# Altium schematic sheet Sheet1.SchDoc (part 1 of 2)
size A1; SheetNumber: 1; SheetTotal: 1; ENG_APP_DATE: --/--/--; DSN_APP_DATE: --/--/--; CHK_APP_DATE: --/--/--
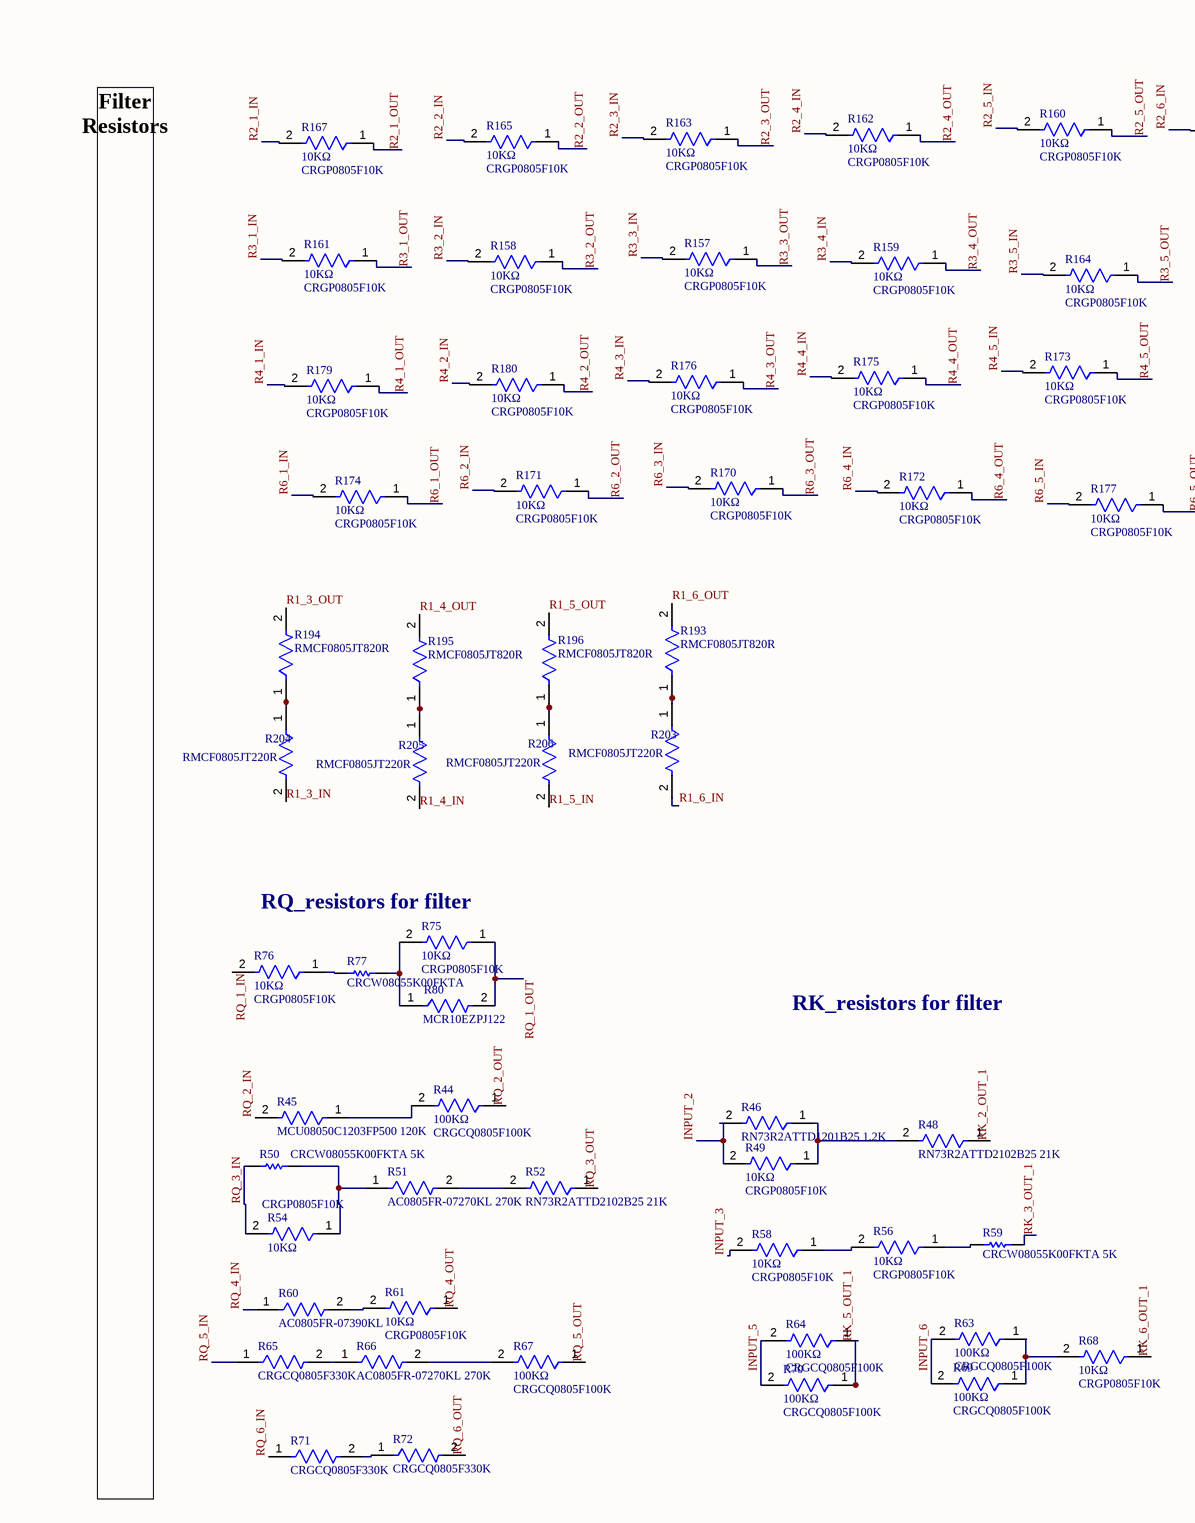
[diagram p0: Sheet1.SchDoc, top left]
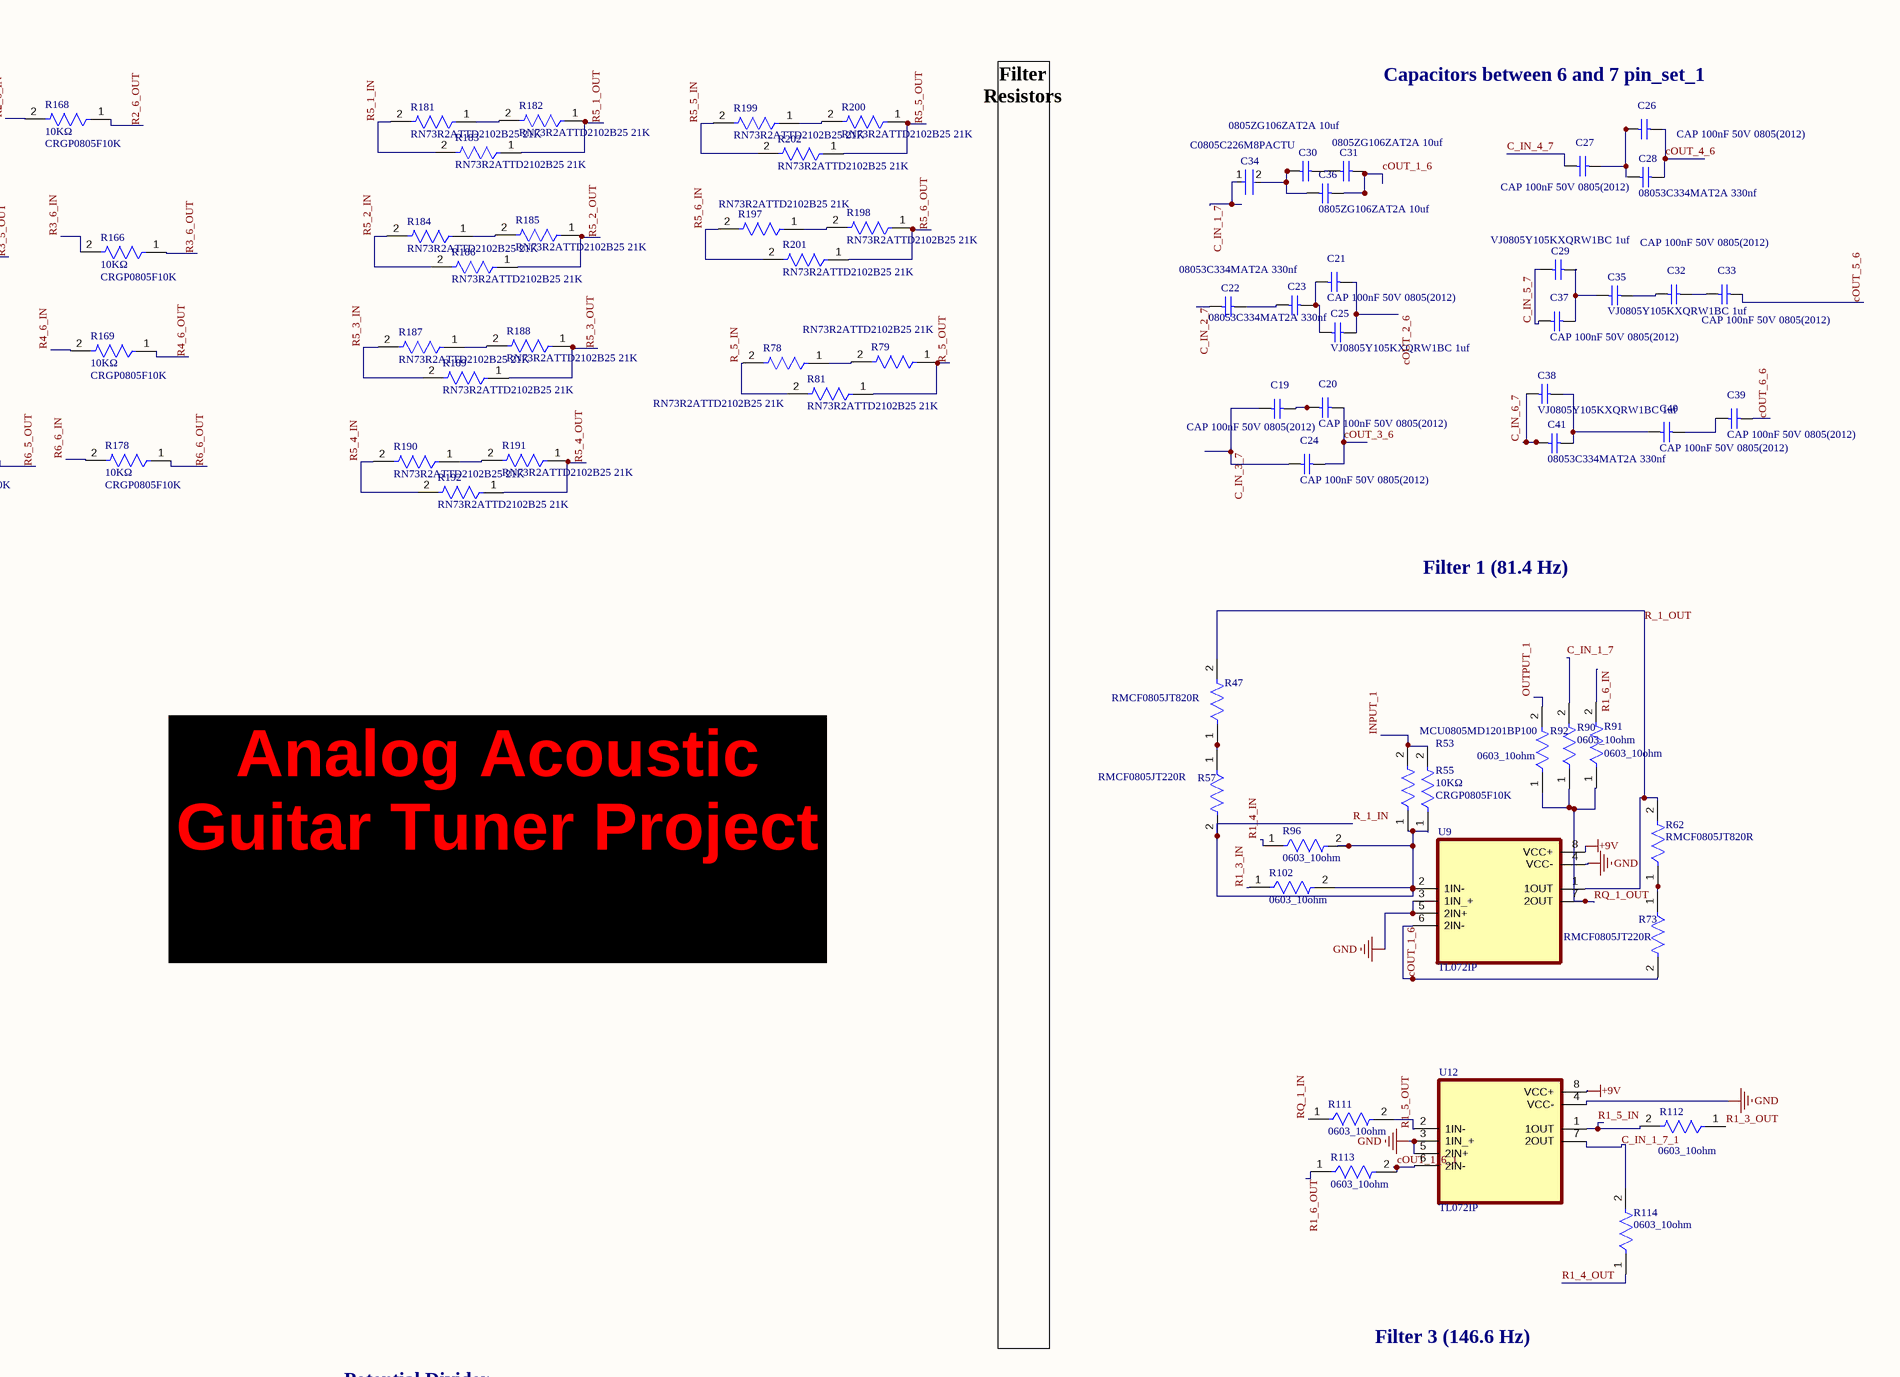
[diagram p1: Sheet1.SchDoc, top middle]
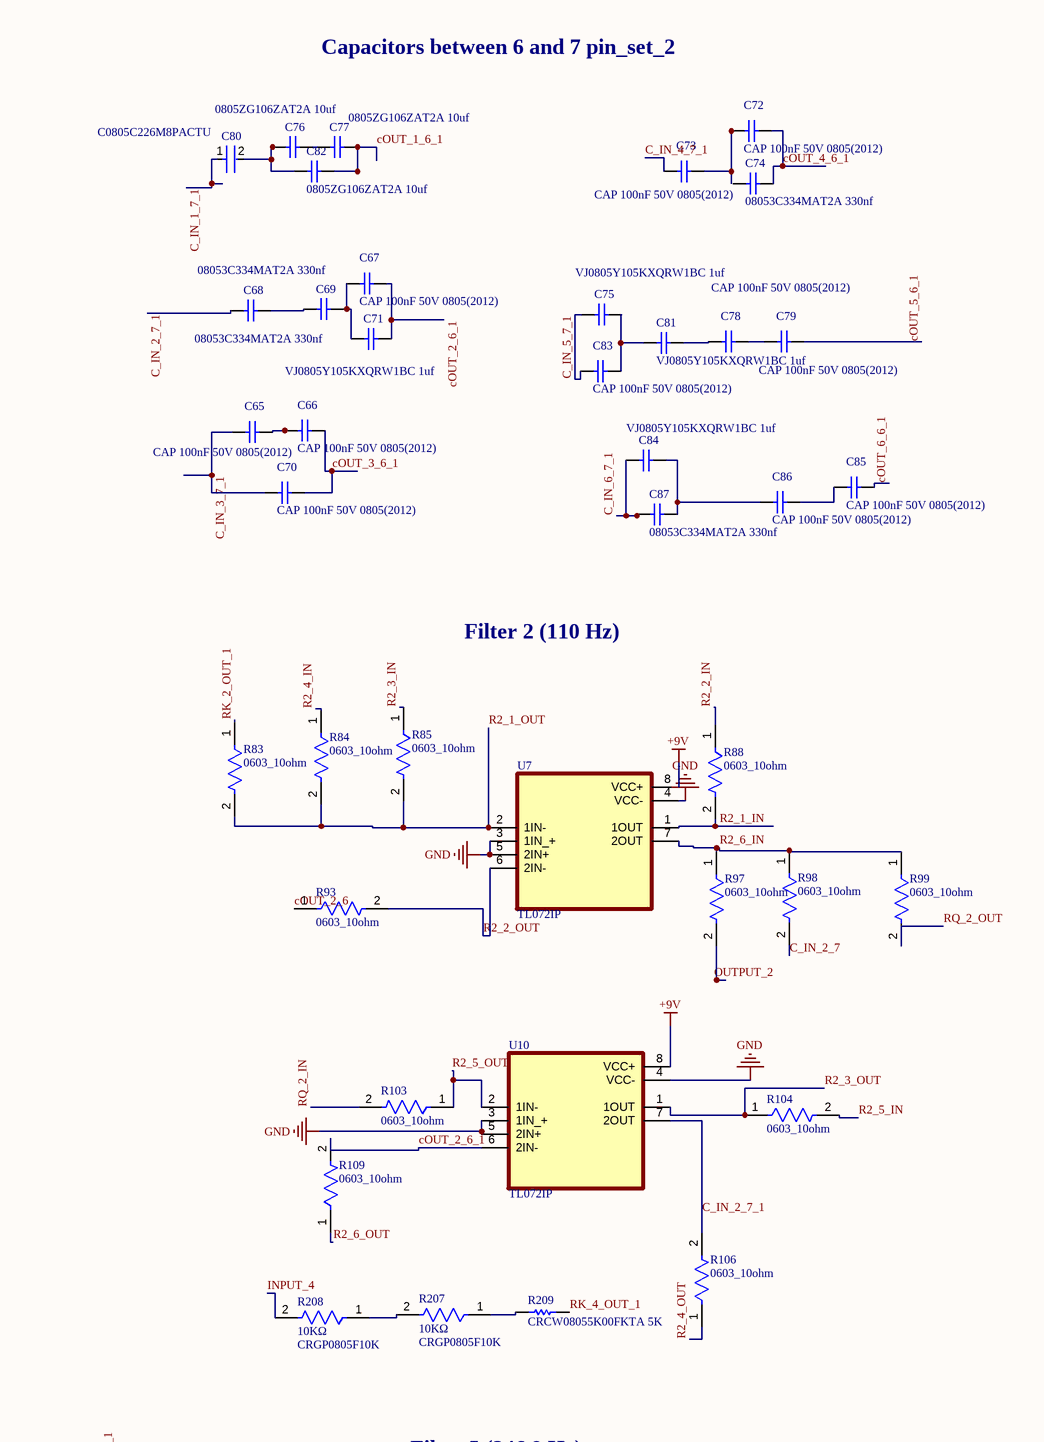
[diagram p2: Sheet1.SchDoc, top right]
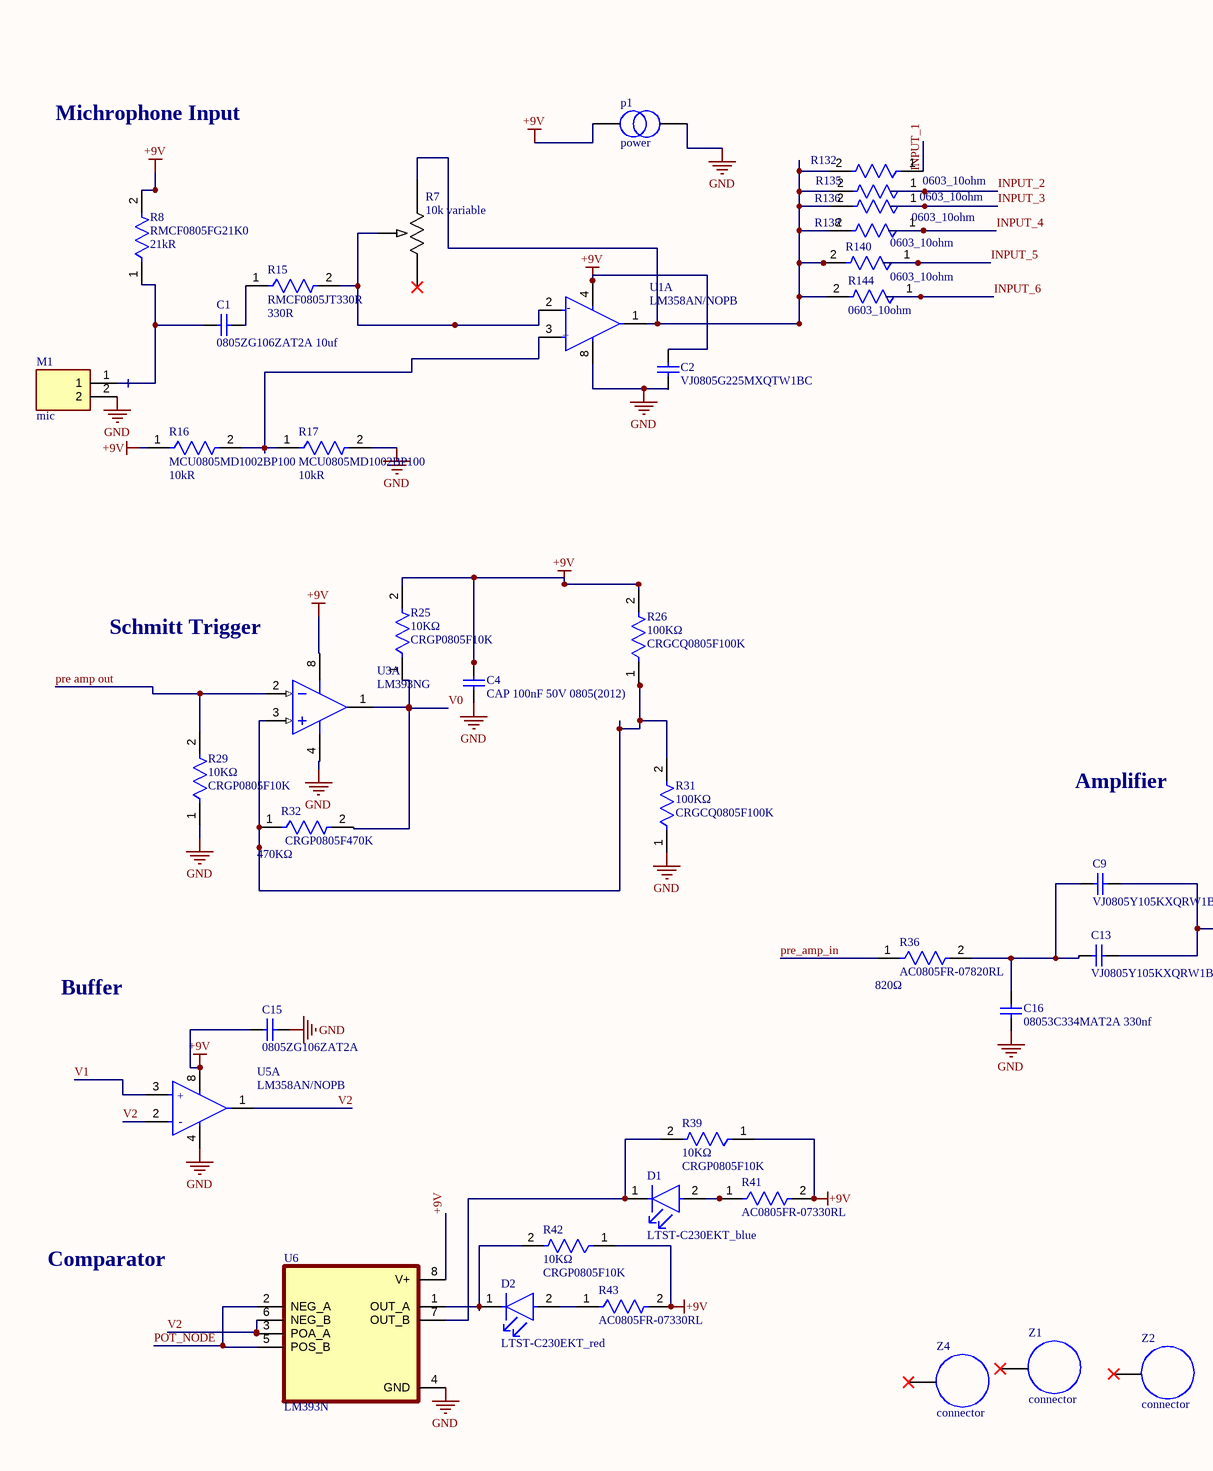
[diagram p3: Sheet1.SchDoc, bottom left]
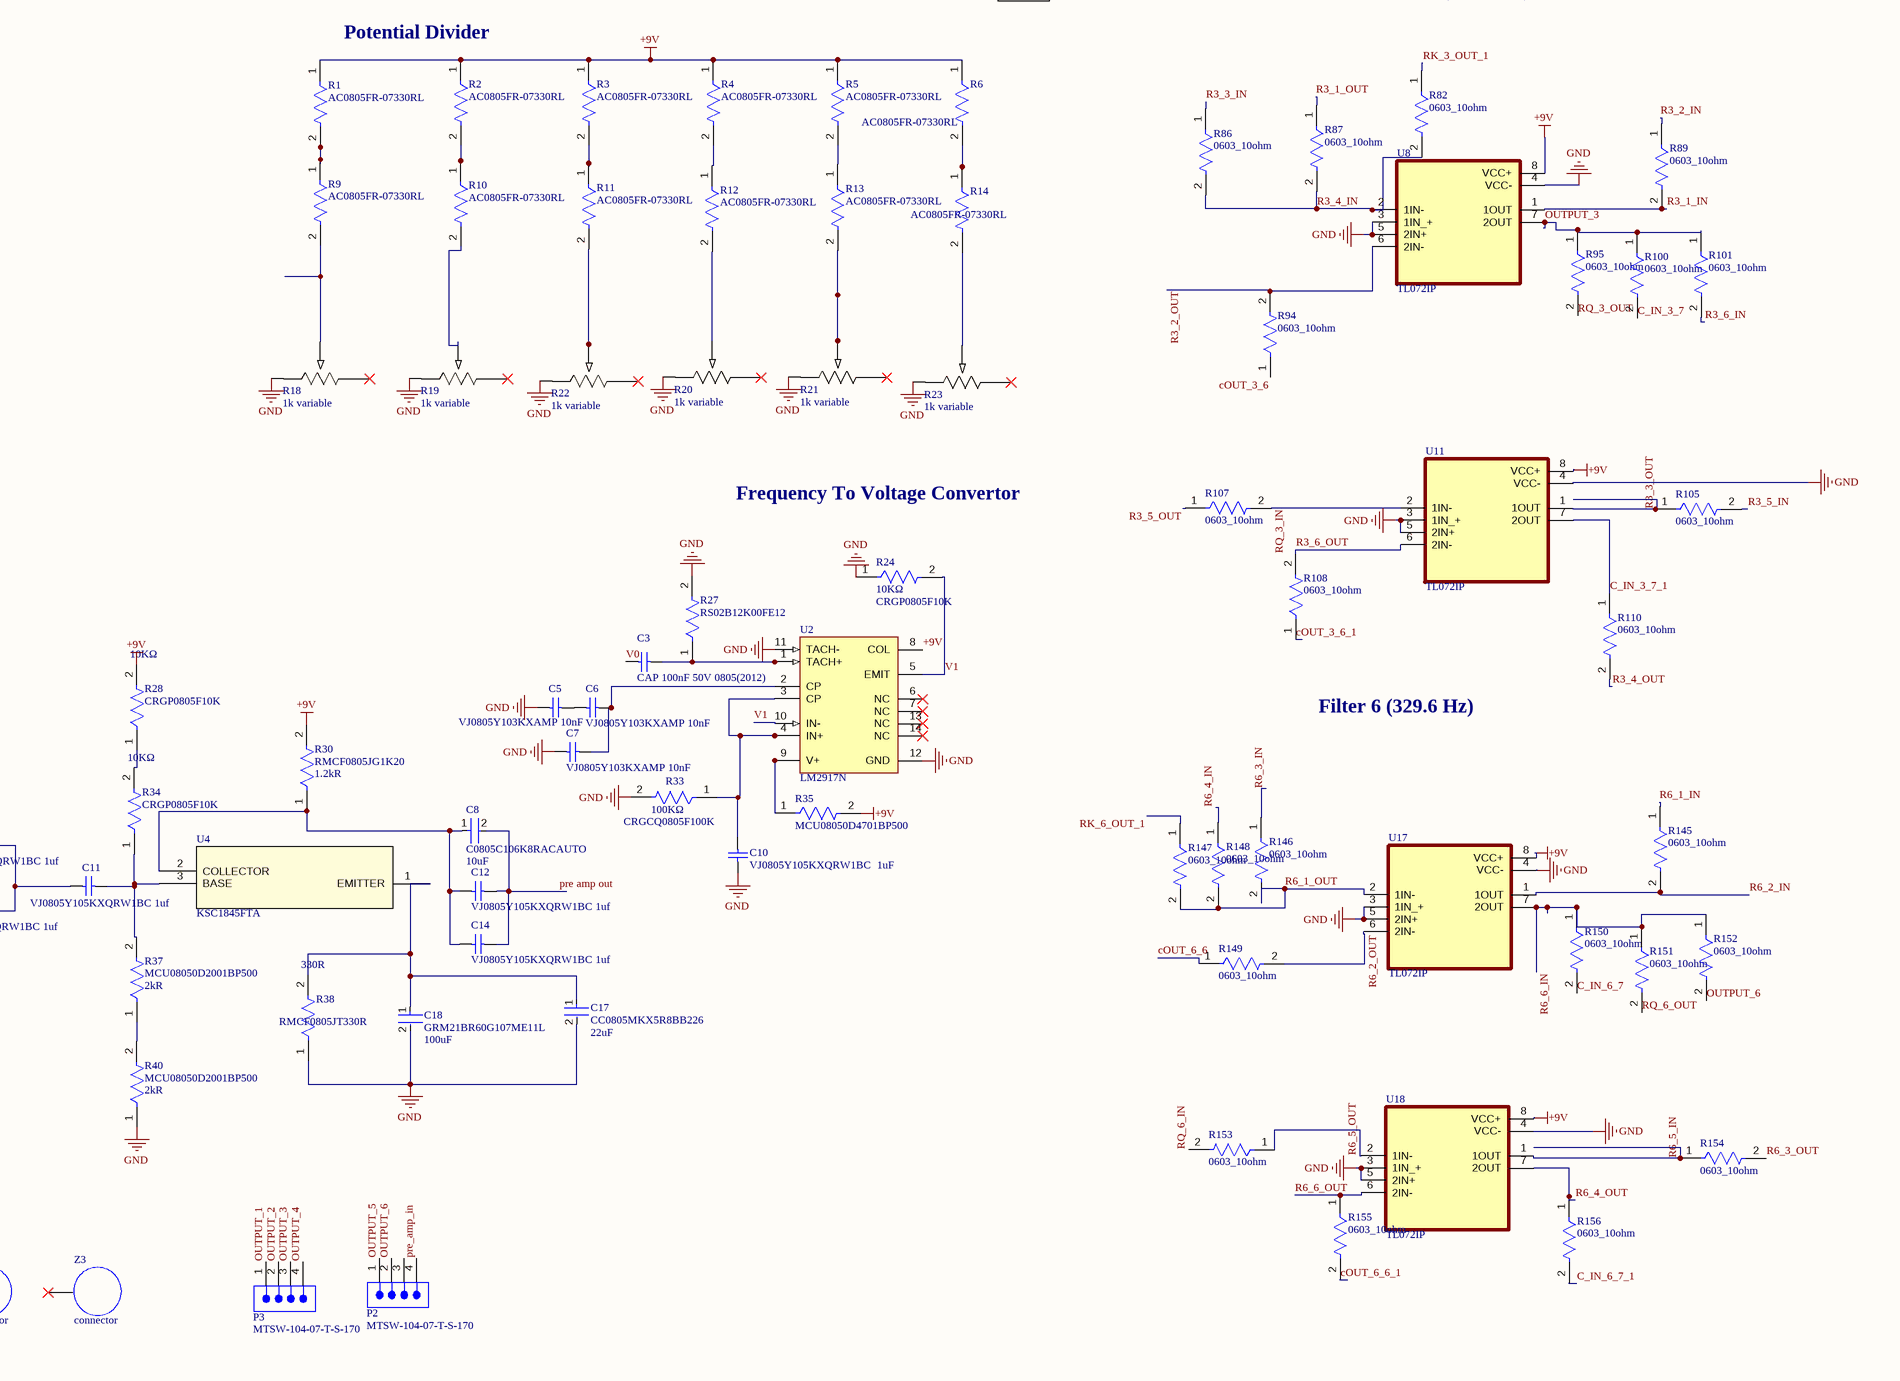
[diagram p4: Sheet1.SchDoc, bottom middle]
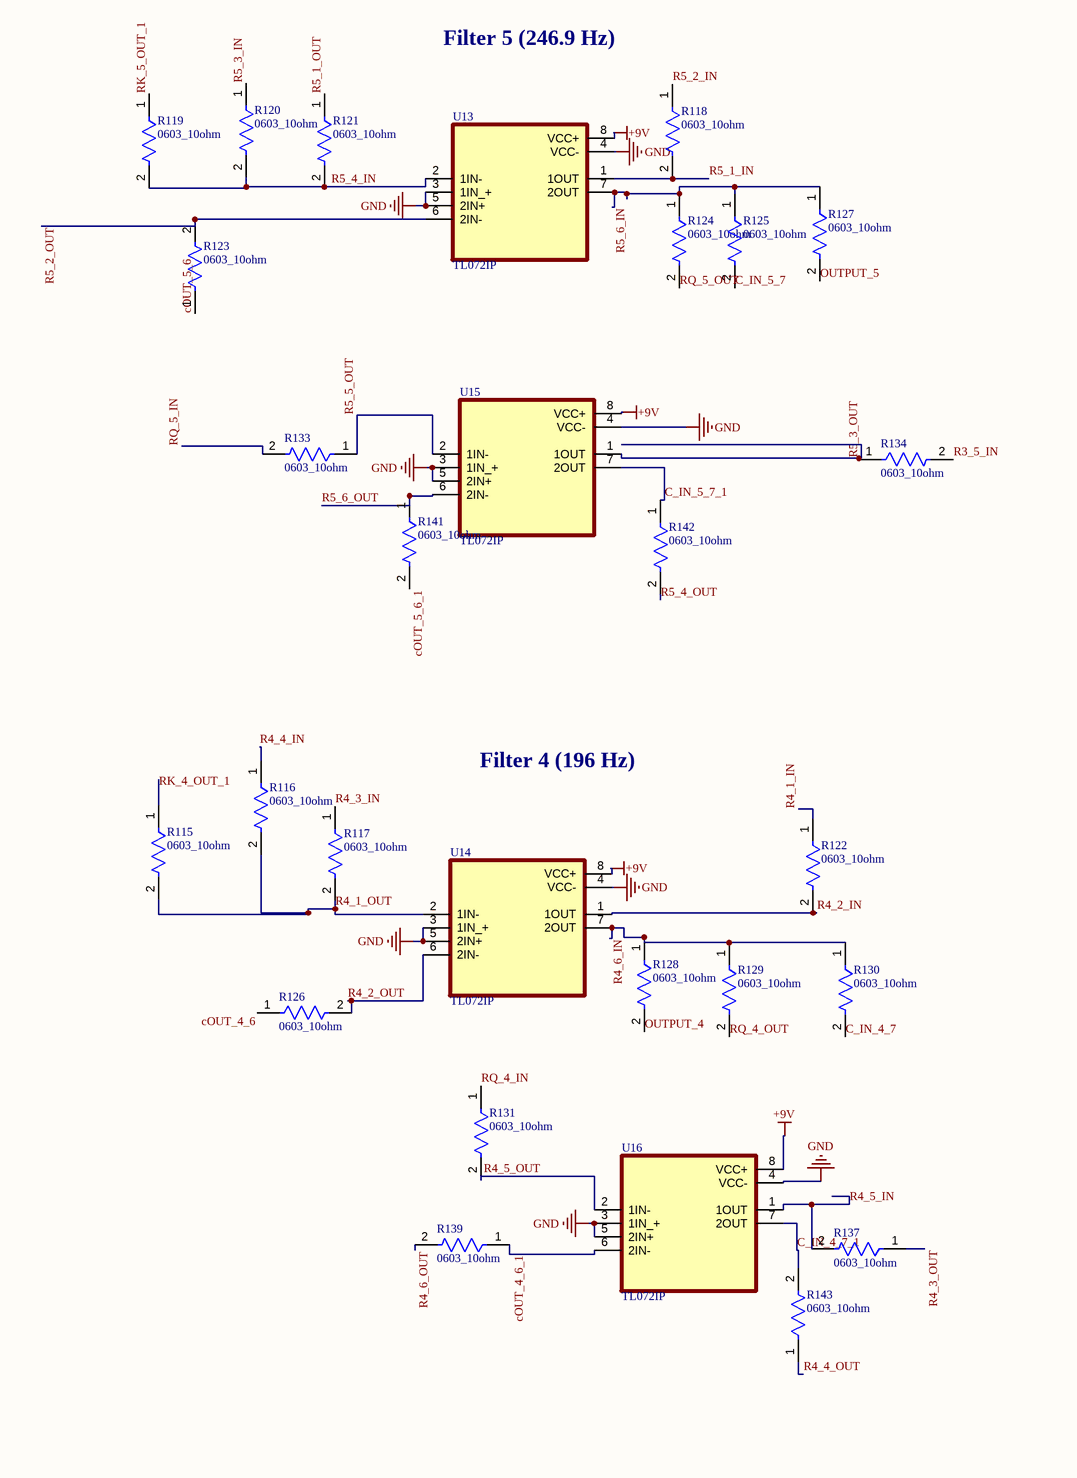
[diagram p5: Sheet1.SchDoc, bottom right]

## Parts
C1  0805ZG106ZAT2A 10uf  [CAPC2013X152X50NL20T25]
C2  VJ0805G225MXQTW1BC  [CAPC2013X145X50ML20T20]
C3  CAP 100nF 50V 0805(2012)  [CAPC0805(2012)145_N]
C4  CAP 100nF 50V 0805(2012)  [CAPC0805(2012)145_N]
C5  VJ0805Y103KXAMP 10nF  [CAPC2013X145X48LL20T23]
C6  VJ0805Y103KXAMP 10nF  [CAPC2013X145X48LL20T23]
C7  VJ0805Y103KXAMP 10nF  [CAPC2013X145X48LL20T23]
C8  C0805C106K8RACAUTO  Capacitance: 10uF  [FP-C0805C106K8RACAUTO-MFG]
C9  VJ0805Y105KXQRW1BC 1uf  [CAPC2013X145X50NL20T20]
C10  VJ0805Y105KXQRW1BC  1uF  [CAPC2013X145X50NL20T20]
C11  VJ0805Y105KXQRW1BC 1uf  [CAPC2013X145X50NL20T20]
C12  VJ0805Y105KXQRW1BC 1uf  [CAPC2013X145X50NL20T20]
C13  VJ0805Y105KXQRW1BC 1uf  [CAPC2013X145X50NL20T20]
C14  VJ0805Y105KXQRW1BC 1uf  [CAPC2013X145X50NL20T20]
C15  0805ZG106ZAT2A  [CAPC2013X152X50NL20T25]
C16  08053C334MAT2A 330nf  [CAPC2013X140X50ML20T25]
C17  CC0805MKX5R8BB226  Capacitance: 22uF  [FP-CC0805-0_2-1_45-IPC_C]
C18  GRM21BR60G107ME11L  Capacitance: 100uF  [FP-GRM21B-0_2-e0_2_0_7-MFG]
C19  CAP 100nF 50V 0805(2012)  [CAPC0805(2012)145_N]
C20  CAP 100nF 50V 0805(2012)  [CAPC0805(2012)145_N]
C21  CAP 100nF 50V 0805(2012)  [CAPC0805(2012)145_N]
C22  08053C334MAT2A 330nf  [CAPC2013X140X50ML20T25]
C23  08053C334MAT2A 330nf  [CAPC2013X140X50ML20T25]
C24  CAP 100nF 50V 0805(2012)  [CAPC0805(2012)145_N]
C25  VJ0805Y105KXQRW1BC 1uf  [CAPC2013X145X50NL20T20]
C26  CAP 100nF 50V 0805(2012)  [CAPC0805(2012)145_N]
C27  CAP 100nF 50V 0805(2012)  [CAPC0805(2012)145_N]
C28  08053C334MAT2A 330nf  [CAPC2013X140X50ML20T25]
C29  VJ0805Y105KXQRW1BC 1uf  [CAPC2013X145X50NL20T20]
C30  0805ZG106ZAT2A 10uf  [CAPC2013X152X50NL20T25]
C31  0805ZG106ZAT2A 10uf  [CAPC2013X152X50NL20T25]
C32  CAP 100nF 50V 0805(2012)  [CAPC0805(2012)145_N]
C33  CAP 100nF 50V 0805(2012)  [CAPC0805(2012)145_N]
C34  C0805C226M8PACTU  [FP-C0805C226M8PACTU-MFG]
C35  VJ0805Y105KXQRW1BC 1uf  [CAPC2013X145X50NL20T20]
C36  0805ZG106ZAT2A 10uf  [CAPC2013X152X50NL20T25]
C37  CAP 100nF 50V 0805(2012)  [CAPC0805(2012)145_N]
C38  VJ0805Y105KXQRW1BC 1uf  [CAPC2013X145X50NL20T20]
C39  CAP 100nF 50V 0805(2012)  [CAPC0805(2012)145_N]
C40  CAP 100nF 50V 0805(2012)  [CAPC0805(2012)145_N]
C41  08053C334MAT2A 330nf  [CAPC2013X140X50ML20T25]
C65  CAP 100nF 50V 0805(2012)  [CAPC0805(2012)145_N]
C66  CAP 100nF 50V 0805(2012)  [CAPC0805(2012)145_N]
C67  CAP 100nF 50V 0805(2012)  [CAPC0805(2012)145_N]
C68  08053C334MAT2A 330nf  [CAPC2013X140X50ML20T25]
C69  08053C334MAT2A 330nf  [CAPC2013X140X50ML20T25]
C70  CAP 100nF 50V 0805(2012)  [CAPC0805(2012)145_N]
C71  VJ0805Y105KXQRW1BC 1uf  [CAPC2013X145X50NL20T20]
C72  CAP 100nF 50V 0805(2012)  [CAPC0805(2012)145_N]
C73  CAP 100nF 50V 0805(2012)  [CAPC0805(2012)145_N]
C74  08053C334MAT2A 330nf  [CAPC2013X140X50ML20T25]
C75  VJ0805Y105KXQRW1BC 1uf  [CAPC2013X145X50NL20T20]
C76  0805ZG106ZAT2A 10uf  [CAPC2013X152X50NL20T25]
C77  0805ZG106ZAT2A 10uf  [CAPC2013X152X50NL20T25]
C78  CAP 100nF 50V 0805(2012)  [CAPC0805(2012)145_N]
C79  CAP 100nF 50V 0805(2012)  [CAPC0805(2012)145_N]
C80  C0805C226M8PACTU  [FP-C0805C226M8PACTU-MFG]
C81  VJ0805Y105KXQRW1BC 1uf  [CAPC2013X145X50NL20T20]
C82  0805ZG106ZAT2A 10uf  [CAPC2013X152X50NL20T25]
C83  CAP 100nF 50V 0805(2012)  [CAPC0805(2012)145_N]
C84  VJ0805Y105KXQRW1BC 1uf  [CAPC2013X145X50NL20T20]
C85  CAP 100nF 50V 0805(2012)  [CAPC0805(2012)145_N]
C86  CAP 100nF 50V 0805(2012)  [CAPC0805(2012)145_N]
C87  08053C334MAT2A 330nf  [CAPC2013X140X50ML20T25]
D1  LTST-C230EKT_blue  [FP-LTST-C230EKT-MFG]
D2  LTST-C230EKT_red  [FP-LTST-C230EKT-MFG]
M1  mic  [CMA4544PFW]
p1  power  [DIP4]
P2  MTSW-104-07-T-S-170  [SMTC-MTSW-104-07-X-S-170]
P3  MTSW-104-07-T-S-170  [SMTC-MTSW-104-07-X-S-170]
R1  AC0805FR-07330RL  [FP-AC0805-MFG]
R2  AC0805FR-07330RL  [FP-AC0805-MFG]
R3  AC0805FR-07330RL  [FP-AC0805-MFG]
R4  AC0805FR-07330RL  [FP-AC0805-MFG]
R5  AC0805FR-07330RL  [FP-AC0805-MFG]
R6  AC0805FR-07330RL  [FP-AC0805-MFG]
R7  10k variable  [variablr resistor]
R8  RMCF0805FG21K0  Resistance: 21kR  [FP-RMCF0805-IPC_C]
R9  AC0805FR-07330RL  [FP-AC0805-MFG]
R10  AC0805FR-07330RL  [FP-AC0805-MFG]
R11  AC0805FR-07330RL  [FP-AC0805-MFG]
R12  AC0805FR-07330RL  [FP-AC0805-MFG]
R13  AC0805FR-07330RL  [FP-AC0805-MFG]
R14  AC0805FR-07330RL  [FP-AC0805-MFG]
R15  RMCF0805JT330R  Resistance: 330R  [FP-RMCF0805-IPC_C]
R16  MCU0805MD1002BP100  Resistance: 10kR  [FP-MCU0805-IPC_C]
R17  MCU0805MD1002BP100  Resistance: 10kR  [FP-MCU0805-IPC_C]
R18  1k variable  [variablr resistor]
R19  1k variable  [variablr resistor]
R20  1k variable  [variablr resistor]
R21  1k variable  [variablr resistor]
R22  1k variable  [variablr resistor]
R23  1k variable  [variablr resistor]
R24  CRGP0805F10K  value 10KΩ  [FP-CRGP0805-IPC_C]
R25  CRGP0805F10K  value 10KΩ  [FP-CRGP0805-IPC_C]
R26  CRGCQ0805F100K  value 100KΩ  [FP-CRGCQ0805-IPC_C]
R27  RS02B12K00FE12  [FP-RS02B-MFG]
R28  CRGP0805F10K  value 10KΩ  [FP-CRGP0805-IPC_C]
R29  CRGP0805F10K  value 10KΩ  [FP-CRGP0805-IPC_C]
R30  RMCF0805JG1K20  Resistance: 1.2kR  [FP-RMCF0805-IPC_A]
R31  CRGCQ0805F100K  value 100KΩ  [FP-CRGCQ0805-IPC_C]
R32  CRGP0805F470K  value 470KΩ  [FP-CRGP0805-IPC_C]
R33  CRGCQ0805F100K  value 100KΩ  [FP-CRGCQ0805-IPC_C]
R34  CRGP0805F10K  value 10KΩ  [FP-CRGP0805-IPC_C]
R35  MCU08050D4701BP500  [FP-MCU0805-MFG]
R36  AC0805FR-07820RL  value 820Ω  [FP-AC0805-MFG]
R37  MCU08050D2001BP500  Resistance: 2kR  [FP-MCU0805-IPC_A]
R38  RMCF0805JT330R  Resistance: 330R  [FP-RMCF0805-IPC_C]
R39  CRGP0805F10K  value 10KΩ  [FP-CRGP0805-IPC_C]
R40  MCU08050D2001BP500  Resistance: 2kR  [FP-MCU0805-IPC_A]
R41  AC0805FR-07330RL  [FP-AC0805-MFG]
R42  CRGP0805F10K  value 10KΩ  [FP-CRGP0805-IPC_C]
R43  AC0805FR-07330RL  [FP-AC0805-MFG]
R44  CRGCQ0805F100K  value 100KΩ  [FP-CRGCQ0805-IPC_C]
R45  MCU08050C1203FP500 120K  [FP-MCU0805-IPC_A]
R46  RN73R2ATTD1201B25 1.2K  [FP-RN73R2A-MFG]
R47  RMCF0805JT820R  [FP-RMCF0805-IPC_C]
R48  RN73R2ATTD2102B25 21K  [FP-RN73R2A-IPC_A]
R49  CRGP0805F10K  value 10KΩ  [FP-CRGP0805-IPC_C]
R50  CRCW08055K00FKTA 5K  [RESC2013X50X30ML20T20]
R51  AC0805FR-07270KL 270K  [FP-AC0805-MFG]
R52  RN73R2ATTD2102B25 21K  [FP-RN73R2A-IPC_A]
R53  MCU0805MD1201BP100  [FP-MCU0805-MFG]
R54  CRGP0805F10K  value 10KΩ  [FP-CRGP0805-IPC_C]
R55  CRGP0805F10K  value 10KΩ  [FP-CRGP0805-IPC_C]
R56  CRGP0805F10K  value 10KΩ  [FP-CRGP0805-IPC_C]
R57  RMCF0805JT220R  [FP-RMCF0805-IPC_A]
R58  CRGP0805F10K  value 10KΩ  [FP-CRGP0805-IPC_C]
R59  CRCW08055K00FKTA 5K  [RESC2013X50X30ML20T20]
R60  AC0805FR-07390KL  [FP-AC0805-MFG]
R61  CRGP0805F10K  value 10KΩ  [FP-CRGP0805-IPC_C]
R62  RMCF0805JT820R  [FP-RMCF0805-IPC_C]
R63  CRGCQ0805F100K  value 100KΩ  [FP-CRGCQ0805-IPC_C]
R64  CRGCQ0805F100K  value 100KΩ  [FP-CRGCQ0805-IPC_C]
R65  CRGCQ0805F330K  [FP-CRGCQ0805-IPC_C]
R66  AC0805FR-07270KL 270K  [FP-AC0805-MFG]
R67  CRGCQ0805F100K  value 100KΩ  [FP-CRGCQ0805-IPC_C]
R68  CRGP0805F10K  value 10KΩ  [FP-CRGP0805-IPC_C]
R69  CRGCQ0805F100K  value 100KΩ  [FP-CRGCQ0805-IPC_C]
R70  CRGCQ0805F100K  value 100KΩ  [FP-CRGCQ0805-IPC_C]
R71  CRGCQ0805F330K  [FP-CRGCQ0805-IPC_C]
R72  CRGCQ0805F330K  [FP-CRGCQ0805-IPC_C]
R73  RMCF0805JT220R  [FP-RMCF0805-IPC_A]
R75  CRGP0805F10K  value 10KΩ  [FP-CRGP0805-IPC_C]
R76  CRGP0805F10K  value 10KΩ  [FP-CRGP0805-IPC_C]
R77  CRCW08055K00FKTA  [RESC2013X50X30ML20T20]
R78  RN73R2ATTD2102B25 21K  [FP-RN73R2A-IPC_A]
R79  RN73R2ATTD2102B25 21K  [FP-RN73R2A-IPC_A]
R80  MCR10EZPJ122  [FP-MCR10-IPC_C]
R81  RN73R2ATTD2102B25 21K  [FP-RN73R2A-IPC_A]
R82  0603_10ohm  [FP-MCT0603-IPC_A]
R83  0603_10ohm  [FP-MCT0603-IPC_A]
R84  0603_10ohm  [FP-MCT0603-IPC_A]
R85  0603_10ohm  [FP-MCT0603-IPC_A]
R86  0603_10ohm  [FP-MCT0603-IPC_A]
R87  0603_10ohm  [FP-MCT0603-IPC_A]
R88  0603_10ohm  [FP-MCT0603-IPC_A]
R89  0603_10ohm  [FP-MCT0603-IPC_A]
R90  0603_10ohm  [FP-MCT0603-IPC_A]
R91  0603_10ohm  [FP-MCT0603-IPC_A]
R92  0603_10ohm  [FP-MCT0603-IPC_A]
R93  0603_10ohm  [FP-MCT0603-IPC_A]
R94  0603_10ohm  [FP-MCT0603-IPC_A]
R95  0603_10ohm  [FP-MCT0603-IPC_A]
R96  0603_10ohm  [FP-MCT0603-IPC_A]
R97  0603_10ohm  [FP-MCT0603-IPC_A]
R98  0603_10ohm  [FP-MCT0603-IPC_A]
R99  0603_10ohm  [FP-MCT0603-IPC_A]
R100  0603_10ohm  [FP-MCT0603-IPC_A]
R101  0603_10ohm  [FP-MCT0603-IPC_A]
R102  0603_10ohm  [FP-MCT0603-IPC_A]
R103  0603_10ohm  [FP-MCT0603-IPC_A]
R104  0603_10ohm  [FP-MCT0603-IPC_A]
R105  0603_10ohm  [FP-MCT0603-IPC_A]
R106  0603_10ohm  [FP-MCT0603-IPC_A]
R107  0603_10ohm  [FP-MCT0603-IPC_A]
R108  0603_10ohm  [FP-MCT0603-IPC_A]
R109  0603_10ohm  [FP-MCT0603-IPC_A]
R110  0603_10ohm  [FP-MCT0603-IPC_A]
R111  0603_10ohm  [FP-MCT0603-IPC_A]
R112  0603_10ohm  [FP-MCT0603-IPC_A]
R113  0603_10ohm  [FP-MCT0603-IPC_A]
R114  0603_10ohm  [FP-MCT0603-IPC_A]
R115  0603_10ohm  [FP-MCT0603-IPC_A]
R116  0603_10ohm  [FP-MCT0603-IPC_A]
R117  0603_10ohm  [FP-MCT0603-IPC_A]
R118  0603_10ohm  [FP-MCT0603-IPC_A]
R119  0603_10ohm  [FP-MCT0603-IPC_A]
R120  0603_10ohm  [FP-MCT0603-IPC_A]
R121  0603_10ohm  [FP-MCT0603-IPC_A]
R122  0603_10ohm  [FP-MCT0603-IPC_A]
R123  0603_10ohm  [FP-MCT0603-IPC_A]
R124  0603_10ohm  [FP-MCT0603-IPC_A]
R125  0603_10ohm  [FP-MCT0603-IPC_A]
R126  0603_10ohm  [FP-MCT0603-IPC_A]
R127  0603_10ohm  [FP-MCT0603-IPC_A]
R128  0603_10ohm  [FP-MCT0603-IPC_A]
R129  0603_10ohm  [FP-MCT0603-IPC_A]
R130  0603_10ohm  [FP-MCT0603-IPC_A]
R131  0603_10ohm  [FP-MCT0603-IPC_A]
R132  0603_10ohm  [FP-MCT0603-IPC_A]
R133  0603_10ohm  [FP-MCT0603-IPC_A]
R134  0603_10ohm  [FP-MCT0603-IPC_A]
R135  0603_10ohm  [FP-MCT0603-IPC_A]
R136  0603_10ohm  [FP-MCT0603-IPC_A]
R137  0603_10ohm  [FP-MCT0603-IPC_A]
R138  0603_10ohm  [FP-MCT0603-IPC_A]
R139  0603_10ohm  [FP-MCT0603-IPC_A]
R140  0603_10ohm  [FP-MCT0603-IPC_A]
R141  0603_10ohm  [FP-MCT0603-IPC_A]
R142  0603_10ohm  [FP-MCT0603-IPC_A]
R143  0603_10ohm  [FP-MCT0603-IPC_A]
R144  0603_10ohm  [FP-MCT0603-IPC_A]
R145  0603_10ohm  [FP-MCT0603-IPC_A]
R146  0603_10ohm  [FP-MCT0603-IPC_A]
R147  0603_10ohm  [FP-MCT0603-IPC_A]
R148  0603_10ohm  [FP-MCT0603-IPC_A]
R149  0603_10ohm  [FP-MCT0603-IPC_A]
R150  0603_10ohm  [FP-MCT0603-IPC_A]
R151  0603_10ohm  [FP-MCT0603-IPC_A]
R152  0603_10ohm  [FP-MCT0603-IPC_A]
R153  0603_10ohm  [FP-MCT0603-IPC_A]
R154  0603_10ohm  [FP-MCT0603-IPC_A]
R155  0603_10ohm  [FP-MCT0603-IPC_A]
R156  0603_10ohm  [FP-MCT0603-IPC_A]
R157  CRGP0805F10K  value 10KΩ  [FP-CRGP0805-IPC_C]
R158  CRGP0805F10K  value 10KΩ  [FP-CRGP0805-IPC_C]
R159  CRGP0805F10K  value 10KΩ  [FP-CRGP0805-IPC_C]
R160  CRGP0805F10K  value 10KΩ  [FP-CRGP0805-IPC_C]
R161  CRGP0805F10K  value 10KΩ  [FP-CRGP0805-IPC_C]
R162  CRGP0805F10K  value 10KΩ  [FP-CRGP0805-IPC_C]
R163  CRGP0805F10K  value 10KΩ  [FP-CRGP0805-IPC_C]
R164  CRGP0805F10K  value 10KΩ  [FP-CRGP0805-IPC_C]
R165  CRGP0805F10K  value 10KΩ  [FP-CRGP0805-IPC_C]
R166  CRGP0805F10K  value 10KΩ  [FP-CRGP0805-IPC_C]
R167  CRGP0805F10K  value 10KΩ  [FP-CRGP0805-IPC_C]
R168  CRGP0805F10K  value 10KΩ  [FP-CRGP0805-IPC_C]
R169  CRGP0805F10K  value 10KΩ  [FP-CRGP0805-IPC_C]
R170  CRGP0805F10K  value 10KΩ  [FP-CRGP0805-IPC_C]
R171  CRGP0805F10K  value 10KΩ  [FP-CRGP0805-IPC_C]
R172  CRGP0805F10K  value 10KΩ  [FP-CRGP0805-IPC_C]
R173  CRGP0805F10K  value 10KΩ  [FP-CRGP0805-IPC_C]
R174  CRGP0805F10K  value 10KΩ  [FP-CRGP0805-IPC_C]
R175  CRGP0805F10K  value 10KΩ  [FP-CRGP0805-IPC_C]
R176  CRGP0805F10K  value 10KΩ  [FP-CRGP0805-IPC_C]
R177  CRGP0805F10K  value 10KΩ  [FP-CRGP0805-IPC_C]
R178  CRGP0805F10K  value 10KΩ  [FP-CRGP0805-IPC_C]
R179  CRGP0805F10K  value 10KΩ  [FP-CRGP0805-IPC_C]
R180  CRGP0805F10K  value 10KΩ  [FP-CRGP0805-IPC_C]
R181  RN73R2ATTD2102B25 21K  [FP-RN73R2A-IPC_A]
R182  RN73R2ATTD2102B25 21K  [FP-RN73R2A-IPC_A]
R183  RN73R2ATTD2102B25 21K  [FP-RN73R2A-IPC_A]
R184  RN73R2ATTD2102B25 21K  [FP-RN73R2A-IPC_A]
R185  RN73R2ATTD2102B25 21K  [FP-RN73R2A-IPC_A]
R186  RN73R2ATTD2102B25 21K  [FP-RN73R2A-IPC_A]
R187  RN73R2ATTD2102B25 21K  [FP-RN73R2A-IPC_A]
R188  RN73R2ATTD2102B25 21K  [FP-RN73R2A-IPC_A]
R189  RN73R2ATTD2102B25 21K  [FP-RN73R2A-IPC_A]
R190  RN73R2ATTD2102B25 21K  [FP-RN73R2A-IPC_A]
R191  RN73R2ATTD2102B25 21K  [FP-RN73R2A-IPC_A]
R192  RN73R2ATTD2102B25 21K  [FP-RN73R2A-IPC_A]
R193  RMCF0805JT820R  [FP-RMCF0805-IPC_C]
R194  RMCF0805JT820R  [FP-RMCF0805-IPC_C]
R195  RMCF0805JT820R  [FP-RMCF0805-IPC_C]
R196  RMCF0805JT820R  [FP-RMCF0805-IPC_C]
R197  RN73R2ATTD2102B25 21K  [FP-RN73R2A-IPC_A]
R198  RN73R2ATTD2102B25 21K  [FP-RN73R2A-IPC_A]
R199  RN73R2ATTD2102B25 21K  [FP-RN73R2A-IPC_A]
R200  RN73R2ATTD2102B25 21K  [FP-RN73R2A-IPC_A]
R201  RN73R2ATTD2102B25 21K  [FP-RN73R2A-IPC_A]
R202  RN73R2ATTD2102B25 21K  [FP-RN73R2A-IPC_A]
R203  RMCF0805JT220R  [FP-RMCF0805-IPC_A]
R204  RMCF0805JT220R  [FP-RMCF0805-IPC_A]
R205  RMCF0805JT220R  [FP-RMCF0805-IPC_A]
R206  RMCF0805JT220R  [FP-RMCF0805-IPC_A]
R207  CRGP0805F10K  value 10KΩ  [FP-CRGP0805-IPC_C]
R208  CRGP0805F10K  value 10KΩ  [FP-CRGP0805-IPC_C]
R209  CRCW08055K00FKTA 5K  [RESC2013X50X30ML20T20]
U1  LM358AN/NOPB  [FP-P0008A-MFG]  (part A of 2)
U2  LM2917N  [N14A]
U3  LM393NG  [ONSC-PDIP-8-626-05_M]  (part A of 2)
U4  KSC1845FTA  [TO-92-3L_5P33X5P2_ONS]
U5  LM358AN/NOPB  [FP-P0008A-MFG]  (part A of 2)
U6  LM393N  [DIP794W45P254L959H508Q8]
U7  TL072IP  [DIP794W45P254L959H508Q8]
U8  TL072IP  [DIP794W45P254L959H508Q8]
U9  TL072IP  [DIP794W45P254L959H508Q8]
U10  TL072IP  [DIP794W45P254L959H508Q8]
U11  TL072IP  [DIP794W45P254L959H508Q8]
U12  TL072IP  [DIP794W45P254L959H508Q8]
U13  TL072IP  [DIP794W45P254L959H508Q8]
U14  TL072IP  [DIP794W45P254L959H508Q8]
U15  TL072IP  [DIP794W45P254L959H508Q8]
U16  TL072IP  [DIP794W45P254L959H508Q8]
U17  TL072IP  [DIP794W45P254L959H508Q8]
U18  TL072IP  [DIP794W45P254L959H508Q8]
Z1  connector  [connector]
Z2  connector  [connector]
Z3  connector  [connector]
Z4  connector  [connector]

## Nets
+9V: C2.2 C4.2 C15.1 p1.1 R1.1 R2.1 R3.1 R4.1 R5.1 R6.1 R8.2 R16.1 R25.2 R26.2 R28.2 R30.2 R35.2 R39.1 R41.2 R42.1 R43.2 U1.4(GND) U2.8(COL) U3.8(VCC) U5.8(V+) U6.8(V+) U7.8(VCC+) U8.8(VCC+) U9.8(VCC+) U10.8(VCC+) U11.8(VCC+) U12.8(VCC+) U13.8(VCC+) U14.8(VCC+) U15.8(VCC+) U16.8(VCC+) U17.8(VCC+) U18.8(VCC+)
GND: C2.1 C4.1 C5.1 C7.1 C10.1 C15.2 C16.1 C17.2 C18.2 M1.2 p1.2 R17.2 R18.1 R19.1 R20.1 R21.1 R22.1 R23.1 R24.1 R27.2 R29.1 R31.1 R33.2 R38.1 R40.1 U1.8(V+) U2.11(TACH-) U2.12(GND) U3.4(GND) U5.4(GND) U6.4(GND) U7.3(1IN_+) U7.4(VCC-) U7.5(2IN+) U8.3(1IN_+) U8.4(VCC-) U8.5(2IN+) U9.3(1IN_+) U9.4(VCC-) U9.5(2IN+) U10.3(1IN_+) U10.4(VCC-) U10.5(2IN+) U11.3(1IN_+) U11.4(VCC-) U11.5(2IN+) U12.3(1IN_+) U12.4(VCC-) U12.5(2IN+) U13.3(1IN_+) U13.4(VCC-) U13.5(2IN+) U14.3(1IN_+) U14.4(VCC-) U14.5(2IN+) U15.3(1IN_+) U15.4(VCC-) U15.5(2IN+) U16.3(1IN_+) U16.4(VCC-) U16.5(2IN+) U17.3(1IN_+) U17.4(VCC-) U17.5(2IN+) U18.3(1IN_+) U18.4(VCC-) U18.5(2IN+)
C_IN_1_7: C34.1 R90.2
C_IN_1_7_1: C80.1 R114.2 U12.7(2OUT)
C_IN_2_7: C22.2 R98.2
C_IN_2_7_1: C68.2 R106.2 U10.7(2OUT)
C_IN_3_7: C19.2 C24.2 R100.2
C_IN_3_7_1: C65.2 C70.2 R110.1 U11.7(2OUT)
C_IN_4_7: C27.2 R130.2
C_IN_4_7_1: C73.2 R143.2 U16.7(2OUT)
C_IN_5_7: C29.1 C37.2 R125.2
C_IN_5_7_1: C75.1 C83.2 R142.1 U15.7(2OUT)
C_IN_6_7: C38.1 C41.2 R150.2
C_IN_6_7_1: C84.1 C87.2 R156.2
cOUT_1_6: C31.2 C36.2 R73.2 U9.6(2IN-)
cOUT_1_6_1: C77.2 C82.2 R113.2 U12.6(2IN-)
cOUT_2_6: C21.1 C25.2 R93.1
cOUT_2_6_1: C67.1 C71.2 R109.2 U10.6(2IN-)
cOUT_3_6: C20.1 C24.1 R94.1
cOUT_3_6_1: C66.1 C70.1 R108.1
cOUT_4_6: C26.1 C28.1 R126.1
cOUT_4_6_1: C72.1 C74.1 R139.1 U16.6(2IN-)
cOUT_5_6: C33.1 R123.1
cOUT_5_6_1: C79.1 R141.2
cOUT_6_6: C39.1 R149.1
cOUT_6_6_1: C85.1 R155.2
INPUT_1: R53.2 R55.2 R132.1
INPUT_2: R46.2 R49.2 R135.1
INPUT_3: R58.2 R136.1
INPUT_4: R138.1 R208.2
INPUT_5: R64.2 R70.2 R140.1
INPUT_6: R63.2 R69.2 R144.1
OUTPUT_1: P3.1 R92.2
OUTPUT_2: P3.2 R97.2
OUTPUT_3: P3.3 R95.1 R100.1 R101.1 U8.7(2OUT)
OUTPUT_4: P3.4 R128.2
OUTPUT_5: P2.1 R127.2
OUTPUT_6: P2.2 R152.2
POT_NODE: U6.2(NEG_A) U6.5(POS_B)
pre amp out: C8.2 C12.2 C14.2 R29.2 U3.2(INA-)
pre_amp_in: P2.4 R36.1
R1_3_IN: R102.1 R204.2
R1_3_OUT: R112.1 R194.2
R1_4_IN: R96.1 R205.2
R1_4_OUT: R114.1 R195.2
R1_5_IN: R112.2 R206.2 U12.1(1OUT)
R1_5_OUT: R111.2 R196.2 U12.2(1IN-)
R1_6_IN: R91.2 R203.2
R1_6_OUT: R113.1 R193.2
R2_1_IN: R88.2 R167.2 U7.1(1OUT)
R2_1_OUT: R83.2 R84.2 R85.2 R167.1 U7.2(1IN-)
R2_2_IN: R88.1 R165.2
R2_2_OUT: R93.2 R165.1 U7.6(2IN-)
R2_3_IN: R85.1 R163.2
R2_3_OUT: R104.1 R163.1 U10.1(1OUT)
R2_4_IN: R84.1 R162.2
R2_4_OUT: R106.1 R162.1
R2_5_IN: R104.2 R160.2
R2_5_OUT: R103.1 R160.1 U10.2(1IN-)
R2_6_IN: R97.1 R98.1 R99.1 R168.2 U7.7(2OUT)
R2_6_OUT: R109.1 R168.1
R3_1_IN: R89.2 R161.2 U8.1(1OUT)
R3_1_OUT: R87.1 R161.1
R3_2_IN: R89.1 R158.2
R3_2_OUT: R94.2 R158.1 U8.6(2IN-)
R3_3_IN: R86.1 R157.2
R3_3_OUT: R105.1 R157.1 U11.1(1OUT)
R3_4_IN: R82.2 R86.2 R87.2 R159.2 U8.2(1IN-)
R3_4_OUT: R110.2 R159.1
R3_5_IN: R105.2 R134.2 R164.2
R3_5_OUT: R107.1 R164.1
R3_6_IN: R101.2 R166.2
R3_6_OUT: R108.2 R166.1 U11.6(2IN-)
R4_1_IN: R122.1 R179.2
R4_1_OUT: R115.2 R116.2 R117.2 R179.1 U14.2(1IN-)
R4_2_IN: R122.2 R180.2 U14.1(1OUT)
R4_2_OUT: R126.2 R180.1 U14.6(2IN-)
R4_3_IN: R117.1 R176.2
R4_3_OUT: R137.1 R176.1
R4_4_IN: R116.1 R175.2
R4_4_OUT: R143.1 R175.1
R4_5_IN: R137.2 R173.2 U16.1(1OUT)
R4_5_OUT: R131.2 R173.1 U16.2(1IN-)
R4_6_IN: R128.1 R129.1 R130.1 R169.2 U14.7(2OUT)
R4_6_OUT: R139.2 R169.1
R5_1_IN: R118.2 R181.2 R183.2 U13.1(1OUT)
R5_1_OUT: R121.1 R182.1 R183.1
R5_2_IN: R118.1 R184.2 R186.2
R5_2_OUT: R123.2 R185.1 R186.1 U13.6(2IN-)
R5_3_IN: R120.1 R187.2 R189.2
R5_3_OUT: R134.1 R188.1 R189.1 U15.1(1OUT)
R5_4_IN: R119.2 R120.2 R121.2 R190.2 R192.2 U13.2(1IN-)
R5_4_OUT: R142.2 R191.1 R192.1
R5_5_IN: R199.2 R202.2
R5_5_OUT: R133.1 R200.1 R202.1 U15.2(1IN-)
R5_6_IN: R124.1 R125.1 R127.1 R197.2 R201.2 U13.7(2OUT)
R5_6_OUT: R141.1 R198.1 R201.1 U15.6(2IN-)
R6_1_IN: R145.1 R174.2
R6_1_OUT: R146.2 R147.2 R148.2 R174.1 U17.2(1IN-)
R6_2_IN: R145.2 R171.2 U17.1(1OUT)
R6_2_OUT: R149.2 R171.1 U17.6(2IN-)
R6_3_IN: R146.1 R170.2
R6_3_OUT: R154.2 R170.1
R6_4_IN: R148.1 R172.2
R6_4_OUT: R156.1 R172.1 U18.7(2OUT)
R6_5_IN: R154.1 R177.2 U18.1(1OUT)
R6_5_OUT: R153.1 R177.1 U18.2(1IN-)
R6_6_IN: R150.1 R151.1 R152.1 R178.2 U17.7(2OUT)
R6_6_OUT: R155.1 R178.1 U18.6(2IN-)
R_1_IN: R53.1 R55.1 R57.2 R96.2 R102.2 U9.2(1IN-)
R_1_OUT: R47.2 R62.2 U9.1(1OUT)
R_5_IN: R78.2 R81.2
R_5_OUT: R79.1 R81.1
RK_2_OUT_1: R48.1 R83.1
RK_3_OUT_1: R59.1 R82.1
RK_4_OUT_1: R115.1 R209.1
RK_5_OUT_1: R64.1 R70.1 R119.1
RK_6_OUT_1: R68.1 R147.1
RQ_1_IN: R76.2 R111.1
RQ_1_OUT: R75.1 R80.2 R90.1 R91.1 R92.1 U9.7(2OUT)
RQ_2_IN: R45.2 R103.2
RQ_2_OUT: R44.1 R99.2
RQ_3_IN: R50.2 R54.2 R107.2 U11.2(1IN-)
RQ_3_OUT: R52.1 R95.2
RQ_4_IN: R60.1 R131.1
RQ_4_OUT: R61.1 R129.2
RQ_5_IN: R65.1 R133.2
RQ_5_OUT: R67.1 R124.2
RQ_6_IN: R71.1 R153.2
RQ_6_OUT: R72.2 R151.2
V0: C3.2 R25.1 R32.2 U3.1(OUTA)
V1: R24.2 U2.5(EMIT) U2.10(IN-) U5.3(NON-INVERTING_INPUT_A)
V2: U5.1(OUTPUT_A) U5.2(INVERTING_INPUT_A) U6.3(POA_A) U6.6(NEG_B)
NetC1_1: C1.1 M1.1 R8.1
NetC1_2: C1.2 R15.1
NetC3_1: C3.1 R27.1 U2.1(TACH+)
NetC5_2: C5.2 C6.1
NetC6_2: C6.2 C7.2 U2.2(CP)
NetC8_1: C8.1 C12.1 C14.1 R30.1 U4.2(COLLECTOR)
NetC9_1: C9.1 C13.1 C16.2 R36.2
NetC9_2: C9.2 C11.1 C13.2
NetC10_2: C10.2 R33.1 U2.3(CP) U2.4(IN+)
NetC11_2: C11.2 R34.1 R37.2 U4.3(BASE)
NetC17_1: C17.1 C18.1 R38.2 U4.1(EMITTER)
NetC19_1: C19.1 C20.2
NetC21_2: C21.2 C23.2 C25.1
NetC22_1: C22.1 C23.1
NetC26_2: C26.2 C27.1
NetC29_2: C29.2 C35.1 C37.1
NetC30_1: C30.1 C34.2 C36.1
NetC30_2: C30.2 C31.1
NetC32_1: C32.1 C33.2
NetC32_2: C32.2 C35.2
NetC38_2: C38.2 C40.2 C41.1
NetC39_2: C39.2 C40.1
NetC65_1: C65.1 C66.2
NetC67_2: C67.2 C69.2 C71.1
NetC68_1: C68.1 C69.1
NetC72_2: C72.2 C73.1
NetC75_2: C75.2 C81.1 C83.1
NetC76_1: C76.1 C80.2 C82.1
NetC76_2: C76.2 C77.1
NetC78_1: C78.1 C79.2
NetC78_2: C78.2 C81.2
NetC84_2: C84.2 C86.2 C87.1
NetC85_2: C85.2 C86.1
NetD1_1: D1.1(C) R39.2 U6.7(OUT_B)
NetD1_2: D1.2(A) R41.1
NetD2_1: D2.1(C) R42.2 U6.1(OUT_A)
NetD2_2: D2.2(A) R43.1
NetR1_2: R1.2 R9.1
NetR2_2: R2.2 R10.1
NetR3_2: R3.2 R11.1
NetR4_2: R4.2 R12.1
NetR5_2: R5.2 R13.1
NetR6_2: R6.2 R14.1
NetR7_2: R7.2 R15.2 U1.2(INVERTING_INPUT_A)
NetR7_3: R7.3 R132.2 R135.2 R136.2 R138.2 R140.2 R144.2 U1.1(OUTPUT_A)
NetR9_2: R9.2 R18.2
NetR10_2: R10.2 R19.2
NetR11_2: R11.2 R22.2
NetR12_2: R12.2 R20.2
NetR13_2: R13.2 R21.2
NetR14_2: R14.2 R23.2
NetR16_2: R16.2 R17.1 U1.3(NON-INVERTING_INPUT_A)
NetR26_1: R26.1 R31.2 R32.1 U3.3(INA+)
NetR28_1: R28.1 R34.2
NetR35_1: R35.1 U2.9(V+)
NetR37_1: R37.1 R40.2
NetR44_2: R44.2 R45.1
NetR46_1: R46.1 R48.2 R49.1
NetR47_1: R47.1 R57.1
NetR50_1: R50.1 R51.1 R54.1
NetR51_2: R51.2 R52.2
NetR56_1: R56.1 R59.2
NetR56_2: R56.2 R58.1
NetR60_2: R60.2 R61.2
NetR62_1: R62.1 R73.1
NetR63_1: R63.1 R68.2 R69.1
NetR65_2: R65.2 R66.1
NetR66_2: R66.2 R67.2
NetR71_2: R71.2 R72.1
NetR75_2: R75.2 R77.2 R80.1
NetR76_1: R76.1 R77.1
NetR78_1: R78.1 R79.2
NetR181_1: R181.1 R182.2
NetR184_1: R184.1 R185.2
NetR187_1: R187.1 R188.2
NetR190_1: R190.1 R191.2
NetR193_1: R193.1 R203.1
NetR194_1: R194.1 R204.1
NetR195_1: R195.1 R205.1
NetR196_1: R196.1 R206.1
NetR197_1: R197.1 R198.2
NetR199_1: R199.1 R200.2
NetR207_1: R207.1 R209.2
NetR207_2: R207.2 R208.1

Not connected (* = marked no-connect by the designer): C28 2; C74 2; P2 3; R7 1*; R18 3*; R19 3*; R20 3*; R21 3*; R22 3*; R23 3*; U2 6(NC)* 7(NC)* 13(NC)* 14(NC)*; Z1 3*; Z2 3*; Z3 3*; Z4 3*

## Notes on the sheet
- (near C26) Capacitors between 6 and 7 pin_set_1
- Capacitors between 6 and 7 pin_set_2
- Filter 1 (81.4 Hz)
- Filter 2 (110 Hz)
- (near R75) RQ_resistors for filter
- RK_resistors for filter
- Analog Acoustic Guitar Tuner Project
- Filter 5 (246.9 Hz)
- Filter Resistors
- Potential Divider
- Filter 3 (146.6 Hz)
- Michrophone Input
- Frequency To Voltage Convertor
- (near U3) Schmitt Trigger
- Filter 4 (196 Hz)
- Filter 6 (329.6 Hz)
- Amplifier
- Buffer
- Comparator
- DWG. NO.
- REV.
- SHT.
- THIS DOCUMENT AND THE DATA DISCLOSED HEREIN OR HEREWITH IS THE PROPERTY OF ALTIUM LIMITED AND MAY BE FREELY DISTRIBUTED IN WHOLE. NO RIGHTS ARE RESERVED OR EXPRESS OR IMPLIED WARANTEE GIVEN.
- REVISION
- DESCRIPTION
- DATE
- APPROVED
- ENG:
- APPROVALS
- PROJECT
- DSN:
- CHK:
- REFERENCE DOCUMENTS
- PROJECT REVISION:
- TITLE
- DOCUMENT REVISION:
- DESIGN ITEM:
- BOM:
- FAB DWG:
- PCB DWG:
- ASSY DWG:
- SCALE:
- SIZE
- B
- CAGE CODE
- FILE NAME
- DWG NO.
- SHEET
- OF
- REV
- (in symbol CMP-04895-000025-1, part A) +; -